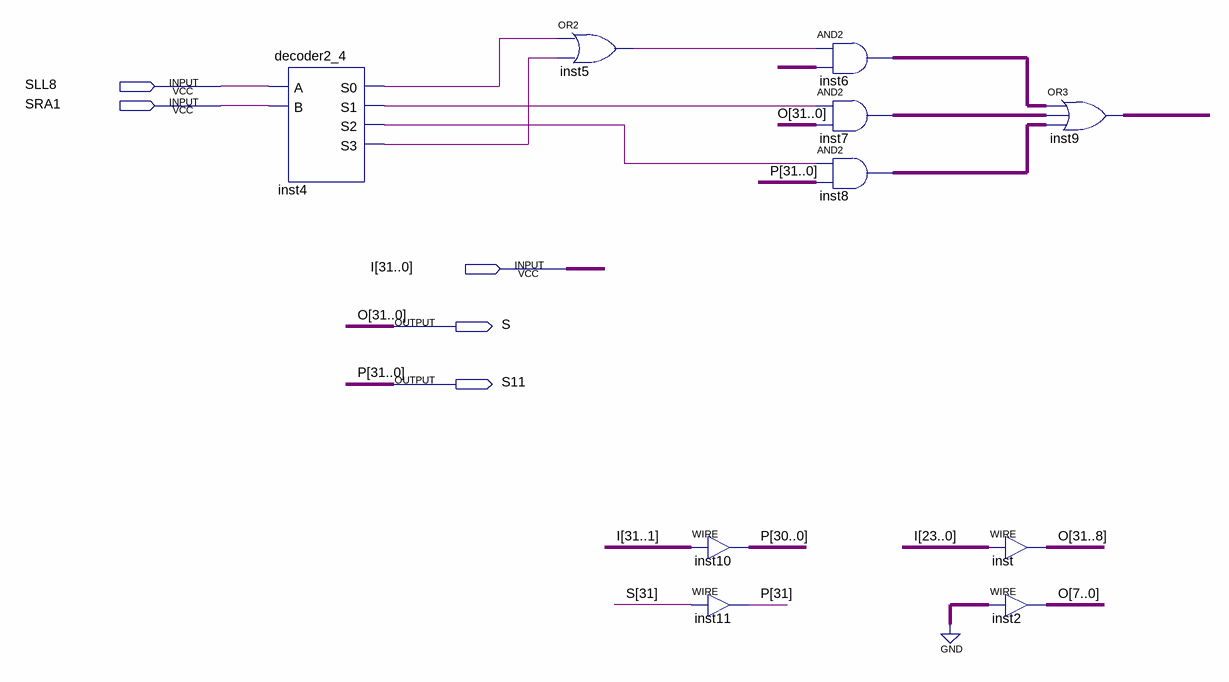
[diagram p0: schematic sheet]
// Quartus schematic SHIFTER.bdf as structural Verilog: 10 symbols, 5 pins
module SHIFTER (
  input  SLL8,
  input  SRA1,
  input  [31:0] I,
  output S,
  output S11
);

  wire inst4_s0, inst4_s1, inst4_s2, inst4_s3, inst5_out;
  wire [31:0] inst6_out, inst7_out, inst8_out, inst9_out, O, P, undriven;
  wire [31:31] S_bus;

  decoder2_4 inst4 (.A(SLL8), .B(SRA1), .S0(inst4_s0), .S1(inst4_s1), .S2(inst4_s2), .S3(inst4_s3));
  or inst5 (inst5_out, inst4_s0, inst4_s3);
  assign P[30:0] = I[31:1];  // WIRE inst10
  assign P[31] = S_bus[31];  // WIRE inst11
  assign inst6_out = {32{inst5_out}} & undriven;  // AND2 inst6, 32 bits wide
  assign inst7_out = {32{inst4_s1}} & O;  // AND2 inst7, 32 bits wide
  assign inst8_out = {32{inst4_s2}} & P;  // AND2 inst8, 32 bits wide
  assign inst9_out = inst6_out | inst7_out | inst8_out;  // OR3 inst9, 32 bits wide
  assign O[31:8] = I[23:0];  // WIRE inst
  assign O[7:0] = {8{1'b0}};  // WIRE inst2
endmodule
